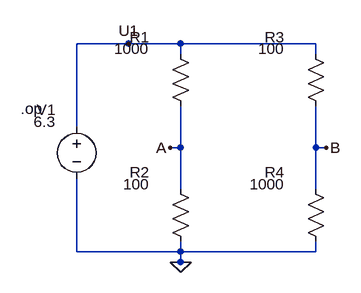
[diagram p0: schematic Brueckenschaltung1.asc]
Brueckenschaltung1.asc, the LTspice schematic file:
Version 4
SHEET 1 880 680
WIRE 176 0 96 0
WIRE 96 0 96 128
WIRE 176 0 256 0
WIRE 256 0 256 16
WIRE 176 0 256 0
WIRE 256 0 464 0
WIRE 464 0 464 16
WIRE 240 160 256 160
WIRE 256 160 256 96
WIRE 240 160 256 160
WIRE 256 160 256 224
WIRE 480 160 464 160
WIRE 464 160 464 96
WIRE 480 160 464 160
WIRE 464 160 464 224
WIRE 256 336 256 320
WIRE 256 320 96 320
WIRE 96 320 96 208
WIRE 256 336 256 320
WIRE 256 320 256 304
WIRE 256 336 256 320
WIRE 256 320 464 320
WIRE 464 320 464 304
FLAG 176 0 U1
FLAG 240 160 A
FLAG 480 160 B
FLAG 256 336 0
FLAG 176 0 U1
FLAG 240 160 A
FLAG 480 160 B
SYMBOL voltage 96 112 R0
WINDOW 0 -32 -10 Right 2
WINDOW 3 -32 8 Right 2
SYMATTR InstName V1
SYMATTR Value 6.3
SYMBOL res 240 0 R0
WINDOW 0 -32 -10 Right 2
WINDOW 3 -32 8 Right 2
SYMATTR InstName R1
SYMATTR Value 1000
SYMBOL res 240 208 R0
WINDOW 0 -32 -10 Right 2
WINDOW 3 -32 8 Right 2
SYMATTR InstName R2
SYMATTR Value 100
SYMBOL res 448 0 R0
WINDOW 0 -32 -10 Right 2
WINDOW 3 -32 8 Right 2
SYMATTR InstName R3
SYMATTR Value 100
SYMBOL res 448 208 R0
WINDOW 0 -32 -10 Right 2
WINDOW 3 -32 8 Right 2
SYMATTR InstName R4
SYMATTR Value 1000
DATAFLAG 320 0 "V(u1)"
DATAFLAG 178 25 "round(V(u1,A)*1e3)/1e3"
DATAFLAG 176 55 "round(I(R1)*1e5)/1e5"
DATAFLAG 182 84 "round(V(U1,A)*I(R1)*1e5)/1e5"
DATAFLAG 175 237 "round(V(A)*1e3)/1e3"
DATAFLAG 176 264 "round(I(R2)*1e5)/1e5"
DATAFLAG 184 295 "round(V(A)*I(R2)*1e5)/1e5"
DATAFLAG 538 38 "round(V(u1,B)*1e3)/1e3"
DATAFLAG 534 64 "round(I(R3)*1e5)/1e5"
DATAFLAG 546 89 "round(V(U1,B)*I(R3)*1e5)/1e5"
DATAFLAG 536 248 "round(V(B)*1e3)/1e3"
DATAFLAG 539 271 "round(I(R4)*1e5)/1e5"
DATAFLAG 547 297 "round(V(B)*I(R4)*1e5)/1e5"
DATAFLAG 304 184 "round(V(A)*1e3)/1e3"
DATAFLAG 536 184 "round(V(B)*1e3)/1e3"
DATAFLAG 0 144 "round(V(u1)*1e3)/1e3"
DATAFLAG 0 176 "-round(I(V1)*1e5)/1e5"
DATAFLAG 0 208 "-round(V(U1)*I(V1)*1e5)/1e5"
TEXT 10 100 Left 2 !.op

The netlist it stands for:
* Brueckenschaltung1.asc
V1 U1 0 6.3
R1 U1 A 1000
R2 A 0 100
R3 U1 B 100
R4 B 0 1000
.op
.backanno
.end